# EAGLE schematic LeadAcid_Battery_Charger_v001 (EAGLE 7.1.0)
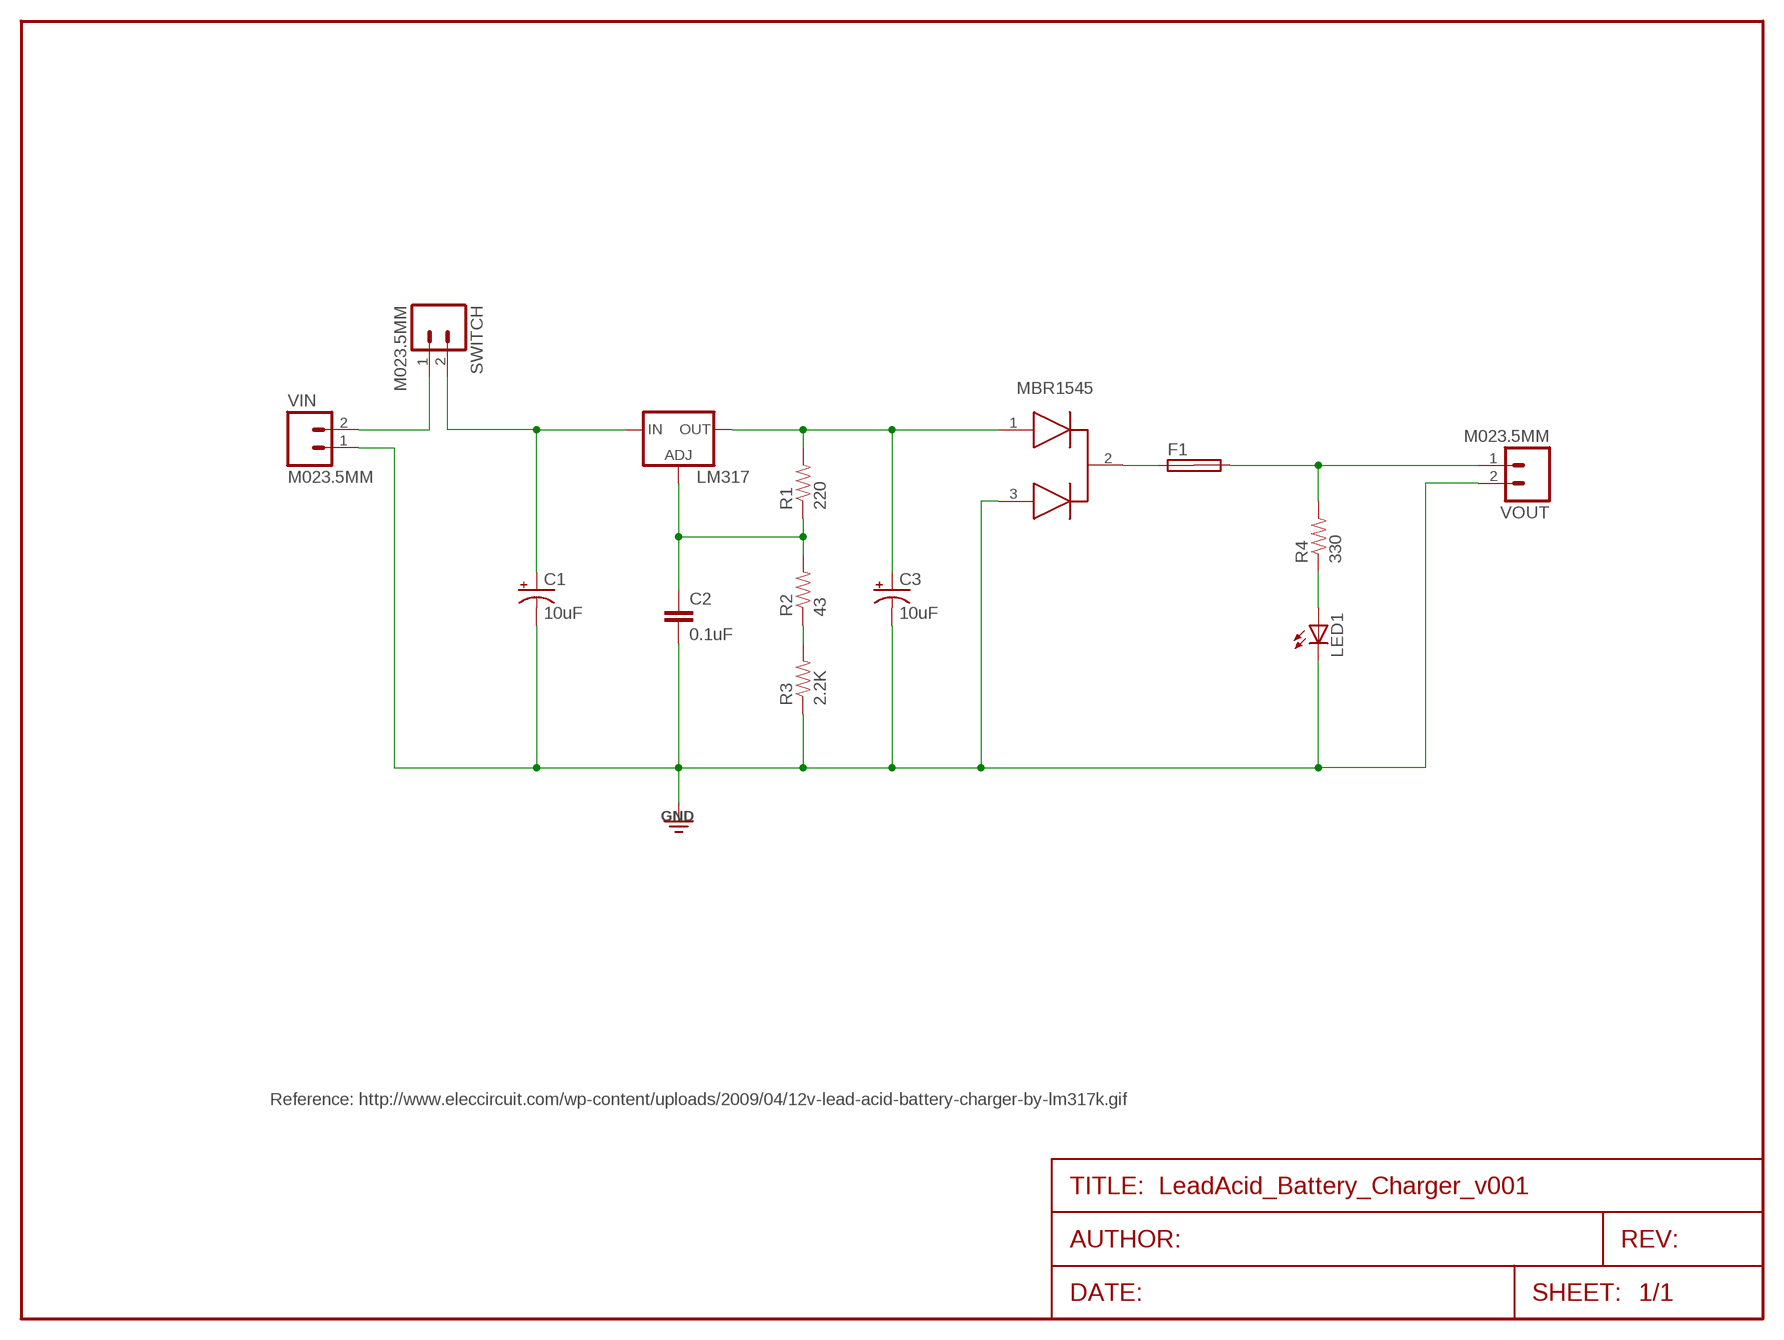
[diagram p0: schematic, sheet 1]

## Parts
C1  10uF  CAP_POLPTH2  [CPOL-RADIAL-10UF-25V]
C2  0.1uF  CAPPTH1  [CAP-PTH-5MM]
C3  10uF  CAP_POLPTH2  [CPOL-RADIAL-10UF-25V]
F1  SHK20L  [SHK20L]
LED1  LED3MM  [LED3MM]
LM317  LM317TS  [317TS]
MBR1545  MBR1545  [TO-220]
R1  220  RESISTORPTH-1/4W  [AXIAL-0.4]
R2  43  RESISTORPTH-1/4W  [AXIAL-0.4]
R3  2.2K  RESISTORPTH-1/4W  [AXIAL-0.4]
R4  330  RESISTORPTH-1/4W  [AXIAL-0.4]
SWITCH  M023.5MM  [SCREWTERMINAL-3.5MM-2]
VIN  M023.5MM  [SCREWTERMINAL-3.5MM-2]
VOUT  M023.5MM  [SCREWTERMINAL-3.5MM-2]

## Nets
GND [pwr]: C1.2(-) C2.2 C3.2(-) LED1.K(C) MBR1545.3 R3.P$1 VIN.1 VOUT.2
N$1 [pwr]: F1.1A MBR1545.2
N$2 [pwr]: C3.1(+) LM317.2(OUT) MBR1545.1 R1.P$2
N$3 [pwr]: F1.2A R4.P$2 VOUT.1
N$4: R2.P$1 R3.P$2
N$5: C2.1 LM317.1(ADJ) R1.P$1 R2.P$2
N$6: LED1.A R4.P$1
N$7 [pwr]: SWITCH.1 VIN.2
N$8 [pwr]: C1.1(+) LM317.3(IN) SWITCH.2
Unconnected: F1.1B F1.2B

## Notes on the sheet
- Reference: http://www.eleccircuit.com/wp-content/uploads/2009/04/12v-lead-acid-battery-charger-by-lm317k.gif

## Library data of the parts
C1 C3 = SparkFun-Passives:CAP_POL: Capacitor Polarized These are standard SMD and PTH capacitors. Normally 10uF, 47uF, and 100uF in electrolytic and tantalum varieties. Always verify the external diameter of the through hole cap, it varies with capacity, voltage, and manufacturer. The EIA devices should be standard.
C2 = SparkFun-Passives:CAP: Capacitor Standard 0603 ceramic capacitor, and 0.1" leaded capacitor.
F1 = fuse:SHK20L: FUSE HOLDER 5 x 20 mm, SH contact, SHH1 Schukat, E1073 Buerklin; OC_FARNELL: unknown; OC_NEWARK: unknown
LED1 = SparkFun-LED:LED: LEDs Standard schematic elements and footprints for 5mm, 3mm, 1206, and 0603 sized LEDs. 5mm - Spark Fun Electronics SKU : COM-00529 (and others)
LM317 = v-reg:LM317TS: VOLTAGE REGULATOR
MBR1545 = Alberto:MBR1545
R1-R4 = SparkFun-Passives:RESISTOR: Resistor Basic schematic elements and footprints for 0603, 1206, and PTH resistors.
SWITCH VIN VOUT = SparkFun-Connectors:M02: Standard 2-pin 0.1" header. Use with - straight break away headers ( PRT-00116) - right angle break away headers (PRT-00553) - swiss pins (PRT-00743) - machine pins (PRT-00117) - female headers (PRT-00115) Molex polarized connector foot print use with: PRT-08233 with associated crimp pins and housings. 2.54_SCREWTERM for use with PRT-10571. 3.5mm Screw Terminal footprints for PRT-08084 5mm Screw Terminal footprints for use with PRT-08433

## Net classes
0 default: width 0.406 mm, clearance 0.203 mm
1 pwr: width 1.016 mm, clearance 0.203 mm